# Altium project chavi-21.PrjPcb
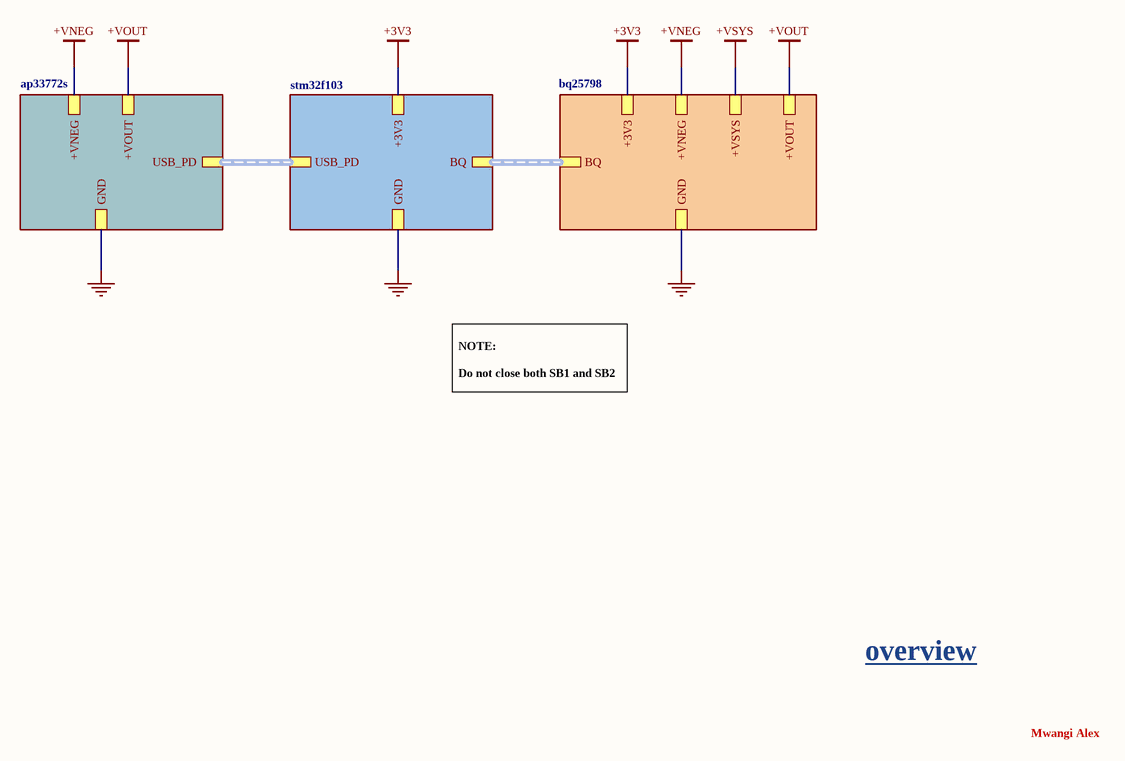
[diagram p0: overview.SchDoc]
4 sheets, 117 parts. Net scope: hierarchical (ports join the sheet entries above them; power ports are global).
Board file: chavi-21.PcbDoc
Sheets:
  overview.SchDoc
    ap33772s = ap33772s.SchDoc
    stm32f103 = stm32f103.SchDoc
    bq25798 = bq25798.SchDoc

## Sheet overview.SchDoc
size A4; SheetNumber: 1; SheetTotal: 4

### Sub-sheets
ap33772s = ap33772s.SchDoc: USB_PD (harness USB_PD), +VNEG, GND, +VOUT
bq25798 = bq25798.SchDoc: BQ (harness BQ_I2C), +VNEG, GND, +3V3, +VSYS, +VOUT
stm32f103 = stm32f103.SchDoc: USB_PD (harness USB_PD), +3V3, GND, BQ (harness BQ)

### Nets
+3V3: sheet stm32f103/+3V3, sheet bq25798/+3V3
+VNEG: sheet ap33772s/+VNEG, sheet bq25798/+VNEG
+VOUT: sheet ap33772s/+VOUT, sheet bq25798/+VOUT
GND: sheet ap33772s/GND, sheet stm32f103/GND, sheet bq25798/GND

### Buses and harness runs
harness sheet ap33772s/USB_PD = sheet stm32f103/USB_PD
harness sheet bq25798/BQ = sheet stm32f103/BQ

### Notes on the sheet
- NOTE:
  Do not close both SB1 and SB2
- overview
- Mwangi Alex

## Sheet ap33772s.SchDoc
size A4; SheetNumber: 3; SheetTotal: 4
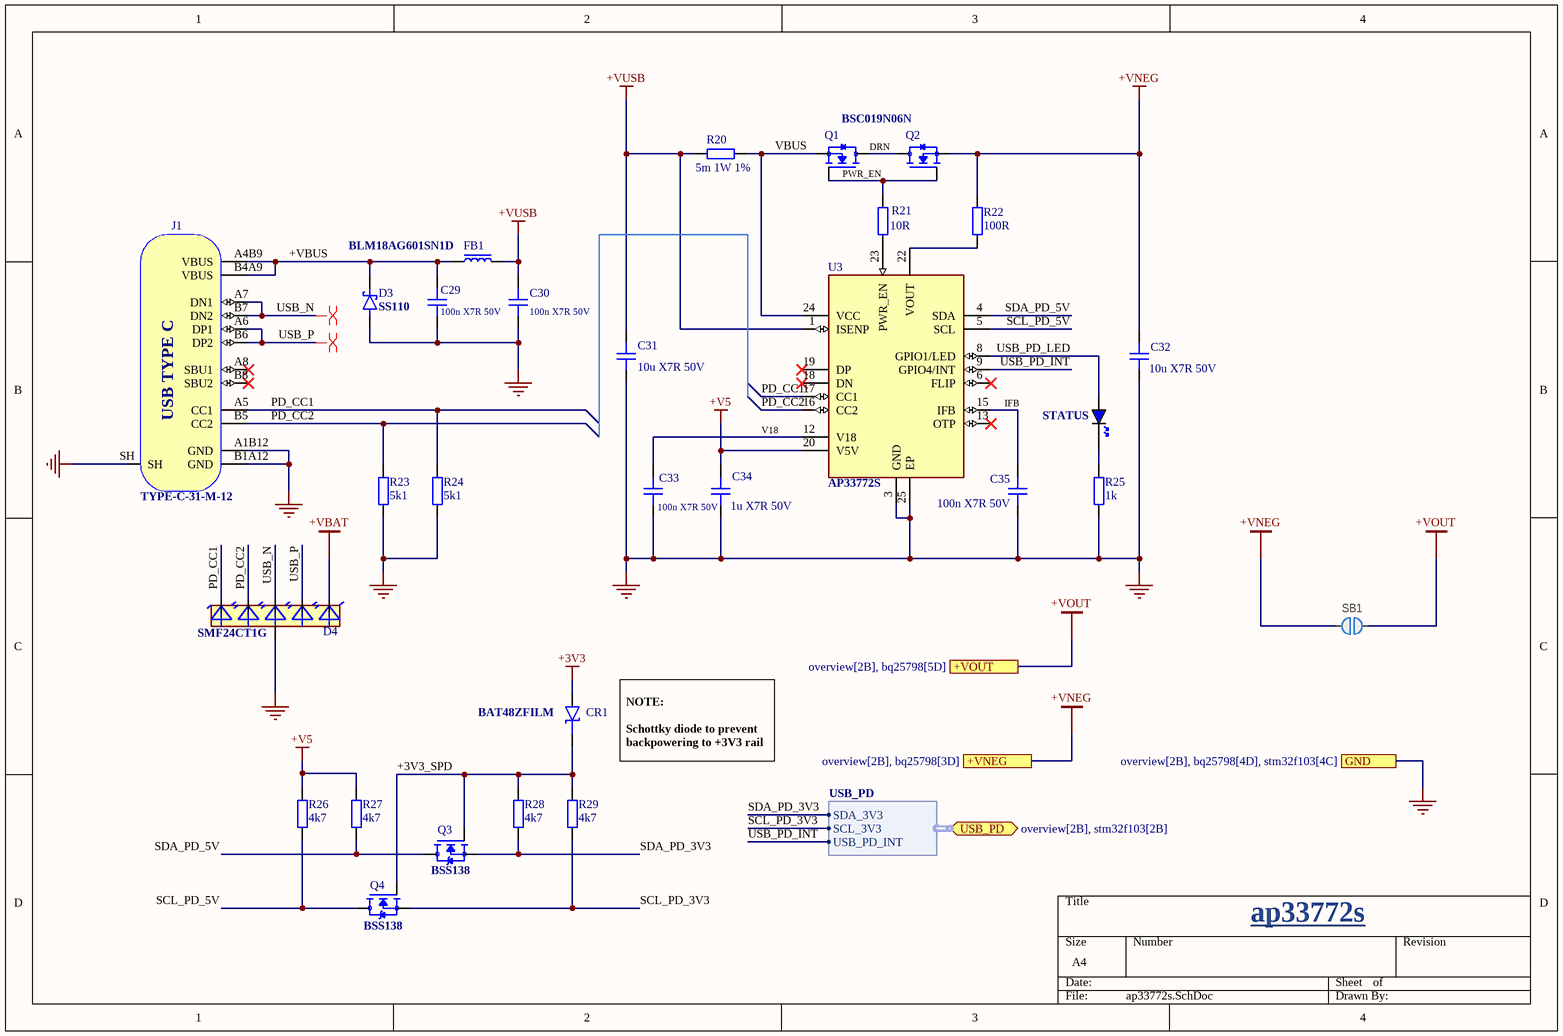
[diagram p1: ap33772s.SchDoc]

### Parts
C29  100n X7R 50V  [CAP_0603]
C30  100n X7R 50V  [CAP_0603]
C31  10u X7R 50V  [CAP_1210]
C32  10u X7R 50V  [CAP_1210]
C33  100n X7R 50V  [CAP_0603]
C34  1u X7R 50V  [CAP_0603]
C35  100n X7R 50V  [CAP_0603]
CR1  BAT48ZFILM  [*SOD-123_STM]
D3  SS110  [DIOM4325X250N]
D4  SMF24CT1G  [SOT65P210X110-6N]
FB1  BLM18AG601SN1D  [FB_0603]
J1  TYPE-C-31-M-12  [TYPE-C-31-M-12]
Q1  BSC019N06N  [BSC014N04LSIATMA1]
Q2  BSC019N06N  [BSC014N04LSIATMA1]  (value not drawn)
Q3  BSS138  [SOT95P240X111-3N]
Q4  BSS138  [SOT95P240X111-3N]
R20  5m 1W 1%  [RES_1206]
R21  10R  [RES_0603]
R22  100R  [RES_0603]
R23  5k1  [RES_0603]
R24  5k1  [RES_0603]
R25  1k  [RES_0603]
R26  4k7  [RES_0603]
R27  4k7  [RES_0603]
R28  4k7  [RES_0603]
R29  4k7  [RES_0603]
SB1  Solderbridge  [Solderbridge]  (value not drawn)  (no BOM)
STATUS  BLUE  [LED_0603_BLUE]  (value not drawn)
U3  AP33772S  [IC_AP33772S]

### Ports
+VNEG (see overview[2B], bq25798[3D]), +VOUT (see overview[2B], bq25798[5D]), GND (see overview[2B], bq25798[4D], stm32f103[4C]), USB_PD (bidir, harness USB_PD, see overview[2B], stm32f103[2B])

### Harnesses
USB_PD: SCL_3V3, SDA_3V3, USB_PD_INT

### Nets
+3V3: CR1.2
+V5: C34.2 R26.2 R27.2 U3.20(V5V)
+VBAT: D4.6(C5)
+VNEG: C32.2 Q2.1(S) R22.2 SB1.1 ; port +VNEG
+VOUT: SB1.2 ; port +VOUT
+VUSB: C30.1 C31.2 FB1.2 R20.1 U3.1(ISENP)
GND: C29.2 C30.2 C31.1 C32.1 C33.2 C34.1 C35.2 D3.A D4.2(A) J1.A1B12(GND) J1.B1A12(GND) J1.SH R23.1 R24.1 R25.2 U3.3(GND) U3.25(EP) ; port GND
+3V3_SPD: CR1.1 Q3.1(G) Q4.1(G) R28.2 R29.2
+VBUS: C29.1 D3.C(K) FB1.1 J1.A4B9(VBUS) J1.B4A9(VBUS)
DRN: Q1.5(D) Q2.5(D)
IFB: C35.1 U3.15(IFB)
PD_CC1: D4.1(C1) J1.A5(CC1) R24.2 U3.17(CC1)
PD_CC2: D4.3(C2) J1.B5(CC2) R23.2 U3.16(CC2)
PWR_EN: Q1.4(G) Q2.4(G) R21.2
SCL_PD_3V3: Q4.2(S) R29.1 ; port USB_PD.SCL_3V3
SCL_PD_5V: Q4.3(D) R26.1 U3.5(SCL)
SDA_PD_3V3: Q3.2(S) R28.1 ; port USB_PD.SDA_3V3
SDA_PD_5V: Q3.3(D) R27.1 U3.4(SDA)
USB_N: D4.4(C3) J1.A7(DN1) J1.B7(DN2)
USB_P: D4.5(C4) J1.A6(DP1) J1.B6(DP2)
USB_PD_INT: U3.9(GPIO4/INT) ; port USB_PD.USB_PD_INT
USB_PD_LED: STATUS.A U3.8(GPIO1/LED)
V18: C33.1 U3.12(V18)
VBUS: Q1.1(S) R20.2 U3.24(VCC)
NetR21_1: R21.1 U3.23(PWR_EN)
NetR22_1: R22.1 U3.22(VOUT)
NetR25_1: R25.1 STATUS.K

Not connected (* = marked no-connect by the designer): J1 A8(SBU1)* B8(SBU2)*; U3 6(FLIP)* 13(OTP)* 18(DN)* 19(DP)*

### Layout directives
differential pair: USB_N, USB_P

### Notes on the sheet
- NOTE:
  Schottky diode to prevent
  backpowering to +3V3 rail
- ap33772s
- (in symbol TYPE-C-31-M-12) USB TYPE C

### Library data of the parts
C29 C30 C33-C35 = CAP_0603: Capacitor SMD 0603; Manufacturer: *; Manufacturer Part Number: *; Distributor Link: *; LCSC: *; Rating: *; Dielectric: *
C31 C32 = CAP_1210: Capacitor SMD 1210; Manufacturer: *; Manufacturer Part Number: *; Distributor Link: *; LCSC: *; Rating: *; Dielectric: *
CR1 = BAT48ZFILM: Diode Schottky 40 V 350mA (DC) Surface Mount SOD-123; MF: STMicroelectronics; SnapEDA_Link: https://www.snapeda.com/parts/BAT48ZFILM/STMicroelectronics/view-part/?ref=snap; Package: SOD-123 STMicroelectronics; MP: BAT48ZFILM; Check_prices: https://www.snapeda.com/parts/BAT48ZFILM/STMicroelectronics/view-part/?ref=eda; Value: *
D3 = SS110: 1A, 100V, Schottky Rectifier; MF: Taiwan Semiconductor; SnapEDA_Link: https://www.snapeda.com/parts/SS110/taiwan/view-part/?ref=snap; Package: SMA-2 Taiwan Semiconductor; Value: *; MP: SS110; Check_prices: https://www.snapeda.com/parts/SS110/taiwan/view-part/?ref=eda
D4 = SMF24CT1G: Quint Uni-Directional TVS Diode, 100W, 6-Pin SC-88 | ON Semiconductor SMF24CT1G; MP: SMF05C; MF: ProTek Devices; Price: None; Availability: In Stock; Package: TSSOP-6 ProTek Devices; SnapEDA_Link: https://www.snapeda.com/parts/SMF05C/Protek+Devices/view-part/?ref=snap; Check_prices: https://www.snapeda.com/parts/SMF05C/Protek+Devices/view-part/?ref=eda; Value: *
FB1 = FB_0603: Ferrite Bead SMD 0603; Manufacturer: *; Manufacturer Part Number: *; Distributor Link: *; LCSC: *
J1 = TYPE-C-31-M-12: USB Type C Connector Horizontal SMT; Manufacturer: Koren Hroparts; Manufacturer Part Number: TYPE-C-31-M-12
Q1 Q2 = BSC019N06N: N-Channel 60 V 100A (Ta) 136W (Ta) Surface Mount PG-TDSON-8 FL; MF: Infineon; MP: IPD122N10N3 G; SnapEDA_Link: https://www.snapeda.com/parts/IPD122N10N3%20G/Infineon/view-part/?ref=snap; Package: TO-252-3 Infineon; Value: *; Check_prices: https://www.snapeda.com/parts/IPD122N10N3%20G/Infineon/view-part/?ref=eda
Q3 Q4 = BSS138: N-Channel 50 V 220mA (Ta) 350mW (Ta) Surface Mount SOT-23-3; MF: onsemi; SnapEDA_Link: https://www.snapeda.com/parts/BSS138/Onsemi/view-part/?ref=snap; Package: SOT-23-3 ON Semiconductor; Value: *; MP: BSS138; Check_prices: https://www.snapeda.com/parts/BSS138/Onsemi/view-part/?ref=eda
R20 = RES_1206: Resistor SMD 1206; Manufacturer: *; Manufacturer Part Number: *; Distributor Link: *; LCSC: *
R21-R29 = RES_0603: Resistor SMD 0603; Manufacturer: *; Manufacturer Part Number: *; Distributor Link: *; LCSC: *
SB1 = Solderbridge: Manufacturer: N.A.; Part number NEMS: 100500458; Pad Count: 2; Component Status: Active; System: Connector; Part Number: Solderbridge; Manufacturer Part Number: N.A.; LatestRevisionDate: 2009-12-14; Published: 2009-12-14; Value: Solderbridge; Note: N.A.; Artikkelnr Noca: N.A.; Footprint Doc: Solderbridge; Part number IPS: N.A.; ComponentLink1URL: N.A.; ComponentLink1Description: Datasheet; ComponentLink2URL: N.A.; ComponentLink2Description: Supplier link; HelpURL: N.A.; Supplier 1: N.A.; Supplier Part Number 1: N.A.; Supplier 2: N.A.; Supplier Part Number 2: N.A.; PartId: 100500458; Component Class: Connectors; Author: rsk; Part number Norautron: N.A.
STATUS = LED_0603_BLUE: LED 0603 BLUE SMD
U3 = AP33772S: USB Controller, PD Sink USB 3.0 USB Interface W-QFN4040-24 (Type A1); MF: Diodes Incorporated; MP: AP33771DKZ-13; Package: None; Price: None; Check_prices: https://www.snapeda.com/parts/AP33771DKZ-13/Diodes+Inc./view-part/?ref=eda; Value: *; SnapEDA_Link: https://www.snapeda.com/parts/AP33771DKZ-13/Diodes+Inc./view-part/?ref=snap; Availability: In Stock; Purchase-URL: https://pricing.snapeda.com/search?q=AP33771DKZ-13&ref=eda

## Sheet stm32f103.SchDoc
size 381 x 203 mm; SheetNumber: 4; SheetTotal: 4
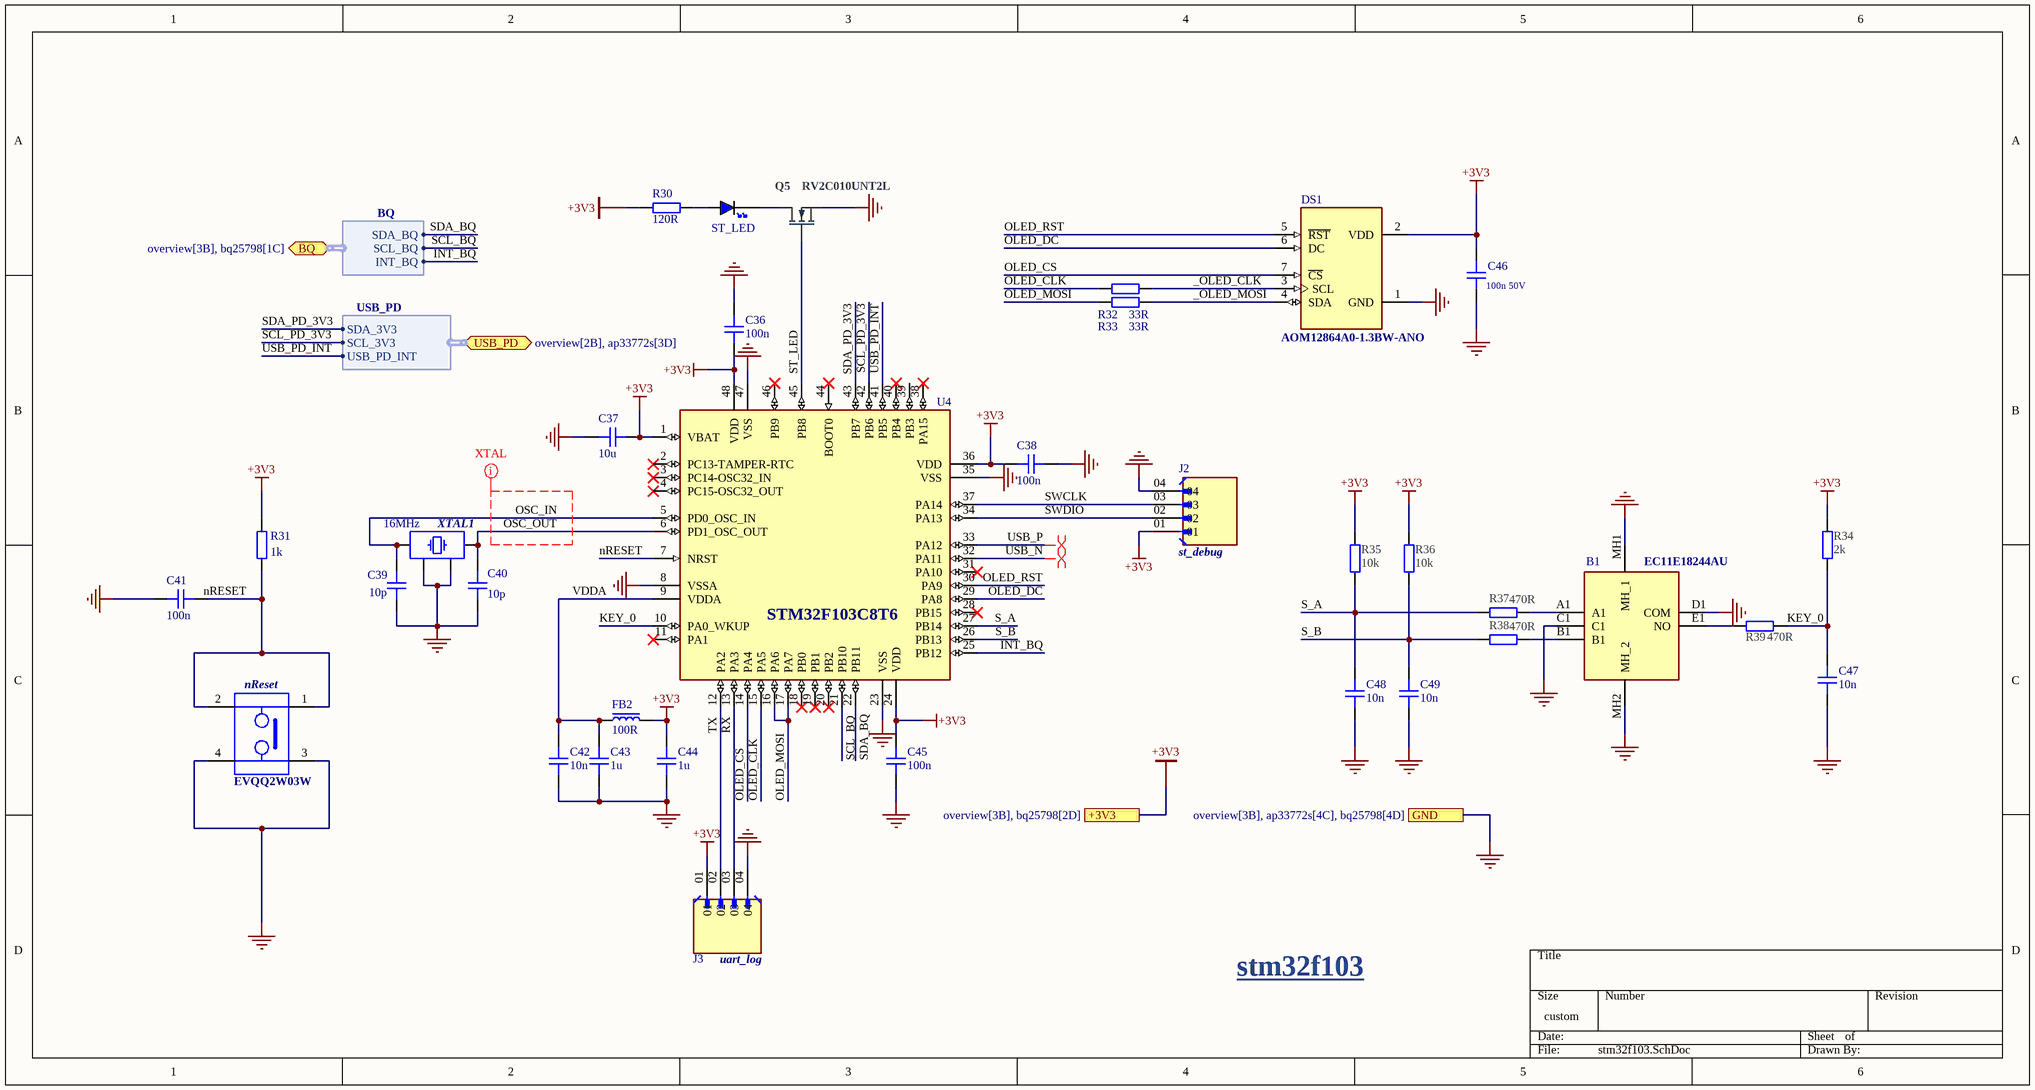
[diagram p2: stm32f103.SchDoc]

### Parts
B1  EC11E18244AU  [EC11E18244AU]
C36  100n  [CAP_0402]
C37  10u  [CAP_0402]
C38  100n  [CAP_0402]
C39  10p  [CAP_0402]
C40  10p  [CAP_0402]
C41  100n  [CAP_0603]
C42  10n  [CAP_0603]
C43  1u  [CAP_0603]
C44  1u  [CAP_0603]
C45  100n  [CAP_0402]
C46  100n 50V  [CAP_0603]
C47  10n  [CAP_0402]
C48  10n  [CAP_0402]
C49  10n  [CAP_0402]
DS1  AOM12864A0-1.3BW-ANO  [LCD_AOM12864A0-1.3BW-ANO]
FB2  100R  [FB_0603]
J2  st_debug  [SAMTEC_TSW-104-08-T-S-LL]
J3  uart_log  [SAMTEC_TSW-104-08-T-S-LL]
nReset  EVQQ2W03W  [EVQQ2W03W]
Q5  RV2C010UNT2L  [DFN65P100X40-3L]
R30  120R  [RES_0603]
R31  1k  [RES_0603]
R32  33R  [RES_0603]
R33  33R  [RES_0603]
R34  2k  [RESC1005X04L]
R35  10k  [RESC1005X04L]
R36  10k  [RESC1005X04L]
R37  470R  [RESC1005X04L]
R38  470R  [RESC1005X04L]
R39  470R  [RESC1005X04L]
ST_LED  BLUE  [LED_0603_BLUE]  (value not drawn)
U4  STM32F103C8T6  [QFP50P900X900X160-48N]
XTAL1  16MHz  [XTAL_2520]

### Ports
+3V3 (see overview[3B], bq25798[2D]), BQ (bidir, harness BQ, see overview[3B], bq25798[1C]), GND (see overview[3B], ap33772s[4C], bq25798[4D]), USB_PD (bidir, harness USB_PD, see overview[2B], ap33772s[3D])

### Harnesses
USB_PD: SCL_3V3, SDA_3V3, USB_PD_INT
BQ: SDA_BQ, SCL_BQ, INT_BQ

### Nets
+3V3: C36.2 C37.2 C38.1 C44.2 C45.2 C46.2 DS1.2(VDD) FB2.2 J2.01 J3.01 R30.2 R31.1 R34.2 R35.2 R36.2 U4.1(VBAT) U4.24(VDD) U4.36(VDD) U4.48(VDD) ; port +3V3
GND: B1.C1 B1.D1(COM) B1.MH1(MH_1) B1.MH2(MH_2) C36.1 C37.1 C38.2 C39.1 C40.1 C41.1 C42.1 C43.1 C44.1 C45.1 C46.1 C47.1 C48.1 C49.1 DS1.1(GND) J2.04 J3.04 nReset.3 nReset.4 Q5.2(S) U4.8(VSSA) U4.23(VSS) U4.35(VSS) U4.47(VSS) XTAL1.2 XTAL1.4 ; port GND
_OLED_CLK: DS1.3(SCL) R32.2
_OLED_MOSI: DS1.4(SDA) R33.2
INT_BQ: U4.25(PB12) ; port BQ.INT_BQ
KEY_0: C47.2 R34.1 R39.2 U4.10(PA0_WKUP)
nRESET: C41.2 nReset.1 nReset.2 R31.2 U4.7(NRST)
OLED_CLK: R32.1 U4.15(PA5)
OLED_CS: DS1.7(~{CS}) U4.14(PA4)
OLED_DC: DS1.6(DC) U4.29(PA8)
OLED_MOSI: R33.1 U4.16(PA6) U4.17(PA7)
OLED_RST: DS1.5(~{RST}) U4.30(PA9)
OSC_IN: C39.2 U4.5(PD0_OSC_IN) XTAL1.3
OSC_OUT: C40.2 U4.6(PD1_OSC_OUT) XTAL1.1
RX: J3.03 U4.13(PA3)
S_A: C48.2 R35.1 R37.1 U4.27(PB14)
S_B: C49.2 R36.1 R38.1 U4.26(PB13)
SCL_BQ: U4.21(PB10) ; port BQ.SCL_BQ
SCL_PD_3V3: U4.42(PB6) ; port USB_PD.SCL_3V3
SDA_BQ: U4.22(PB11) ; port BQ.SDA_BQ
SDA_PD_3V3: U4.43(PB7) ; port USB_PD.SDA_3V3
ST_LED: Q5.1(G) U4.45(PB8)
SWCLK: J2.03 U4.37(PA14)
SWDIO: J2.02 U4.34(PA13)
TX: J3.02 U4.12(PA2)
USB_N: U4.32(PA11)
USB_P: U4.33(PA12)
USB_PD_INT: U4.41(PB5) ; port USB_PD.USB_PD_INT
VDDA: C42.2 C43.2 FB2.1 U4.9(VDDA)
NetB1_A1: B1.A1 R37.2
NetB1_B1: B1.B1 R38.2
NetB1_E1: B1.E1(NO) R39.1
NetQ5_3: Q5.3(D) ST_LED.K
NetR30_1: R30.1 ST_LED.A

Not connected (* = marked no-connect by the designer): U4 2(PC13-TAMPER-RTC)* 3(PC14-OSC32_IN)* 4(PC15-OSC32_OUT)* 11(PA1)* 18(PB0)* 19(PB1)* 20(PB2)* 28(PB15)* 31(PA10)* 38(PA15)* 39(PB3) 40(PB4)* 44(BOOT0)* 46(PB9)*

### Layout directives
mark named XTAL: OSC_IN, OSC_OUT
differential pair: USB_N, USB_P

### Notes on the sheet
- stm32f103

### Library data of the parts
B1 = EC11E18244AU: Alps 18 Pulse Incremental Mechanical Rotary Encoder with a 6 mm Flat Shaft (Not Indexed), Through Hole 10mA 5V DC; Manufacturer_Name: ALPS Electric; Geometry.Height: 24.5mm; Mouser Part Number: 688-EC11E18244AU; Mouser Price/Stock: https://www.mouser.co.uk/ProductDetail/Alps-Alpine/EC11E18244AU?qs=YMSFtX0bdJDrS4vspzwcPg%3D%3D; Manufacturer_Part_Number: EC11E18244AU; Datasheet Link: https://tech.alpsalpine.com/cms.media/product_catalog_ec_01_ec11e_en_611f078659.pdf
C36-C40 C45 C47-C49 = CAP_0402: Capacitor SMD 0402; Manufacturer: *; Manufacturer Part Number: *; Distributor Link: *; LCSC: *; Rating: *; Dielectric: *
C41-C44 C46 = CAP_0603: Capacitor SMD 0603; Manufacturer: *; Manufacturer Part Number: *; Distributor Link: *; LCSC: *; Rating: *; Dielectric: *
DS1 = AOM12864A0-1.3BW-ANO: Non-Touch Graphic LCD Display Module - Blue OLED SPI 1.3 (33.02mm) 128 x 64; MF: Orient Display; SnapEDA_Link: https://www.snapeda.com/parts/AOM12864A0-1.3BW-ANO/Orient+Display/view-part/?ref=snap; Package: None; Value: *; MP: AOM12864A0-1.3BW-ANO; Check_prices: https://www.snapeda.com/parts/AOM12864A0-1.3BW-ANO/Orient+Display/view-part/?ref=eda
FB2 = FB_0603: Ferrite Bead SMD 0603; Manufacturer: *; Manufacturer Part Number: *; Distributor Link: *; LCSC: *
J2 J3 = 4PIN_TSW-104-08-T-S-LL: MF: Samtec; Availability: Unavailable; Value: *; Package: None; Price: None; MP: TSW-104-08-T-S-LL
nReset = EVQQ2W03W: White Push Plate Tactile Switch, SPST-NO 20 mA 3.1mm; MF: Panasonic; Package: None; Check_prices: https://www.snapeda.com/parts/EVQQ2W03W/Panasonic/view-part/?ref=eda; SnapEDA_Link: https://www.snapeda.com/parts/EVQQ2W03W/Panasonic/view-part/?ref=snap; Price: None; Availability: In Stock; MP: EVQQ2W03W; Value: *
Q5 = RV2C010UNT2L: N-Channel MOSFET, 20V, 1A, 470mOhm, 400mW; Manufacturer: Rohm Semiconductor; Part number IPS: 00000009976; Part number Norautron: 26320026; Part number NEMS: 101300132; Note: N.A.; Artikkelnr Noca: 35010020; Pad Count: 3; Component Status: Active; Part Number: RV2C010UNT2L; Manufacturer Part Number: RV2C010UNT2L; ComponentLink1URL: N.A.; ComponentLink1Description: Datasheet; ComponentLink2URL: N.A.; ComponentLink2Description: Supplier link; HelpURL: http://rohmfs.rohm.com/en/products/databook/datasheet/discrete/transistor/mosfet/rv2c010unt2l-e.pdf; Footprint Doc: DFN-3; LatestRevisionDate: 2016-08-09; Published: 2016-08-09; Value: RV2C010UNT2L; Supplier 1: Digi-Key; Supplier Part Number 1: RV2C010UNT2LCT-ND; Supplier 2: Mouser; Supplier Part Number 2: 755-RV2C010UNT2L; PartId: 101300132; Component Class: Semiconductors; Author: rsk
R30-R33 = RES_0603: Resistor SMD 0603; Manufacturer: *; Manufacturer Part Number: *; Distributor Link: *; LCSC: *
R34-R39 = R0402-0R: Resistor, ±5%, 0.063W; Manufacturer: N.A.; Part number IPS: 00000007128; Part number NEMS: 100100109; Value: 0R; Note: Chip Res 5%; Artikkelnr Noca: 27049000; Pad Count: 2; Component Status: Active; Part Number: R0402-0R; Manufacturer Part Number: N.A.; ComponentLink1URL: N.A.; ComponentLink1Description: Datasheet; ComponentLink2URL: N.A.; ComponentLink2Description: Supplier link; HelpURL: N.A.; Footprint Doc: 0402; LatestRevisionDate: 2009-11-23; Published: 2009-05-08; Supplier 1: Farnell; Supplier Part Number 1: 146-9661; Supplier 2: N.A.; Supplier Part Number 2: N.A.; PartId: 100100109; Component Class: Resistors; Author: rsk; Part number Norautron: N.A.
ST_LED = LED_0603_BLUE: LED 0603 BLUE SMD
U4 = STM32F103C8T6: ARMÂ® CortexÂ®-M3 STM32F1 Microcontroller IC 32-Bit 72MHz 64KB (64K x 8) FLASH 48-LQFP (7x7); MF: STMicroelectronics; Package: LQFP-48 STMicroelectronics; Price: None; Check_prices: https://www.snapeda.com/parts/STM32F103C8T6/STMicroelectronics/view-part/?ref=eda; Value: *; SnapEDA_Link: https://www.snapeda.com/parts/STM32F103C8T6/STMicroelectronics/view-part/?ref=snap; MP: STM32F103C8T6; Availability: In Stock; Purchase-URL: https://pricing.snapeda.com/search/part/STM32F103C8T6/?ref=eda
XTAL1 = XTAL_2520: Crystal SMD 2520; Distributor Link: *

## Sheet bq25798.SchDoc
size 381 x 241 mm; SheetNumber: 2; SheetTotal: 4
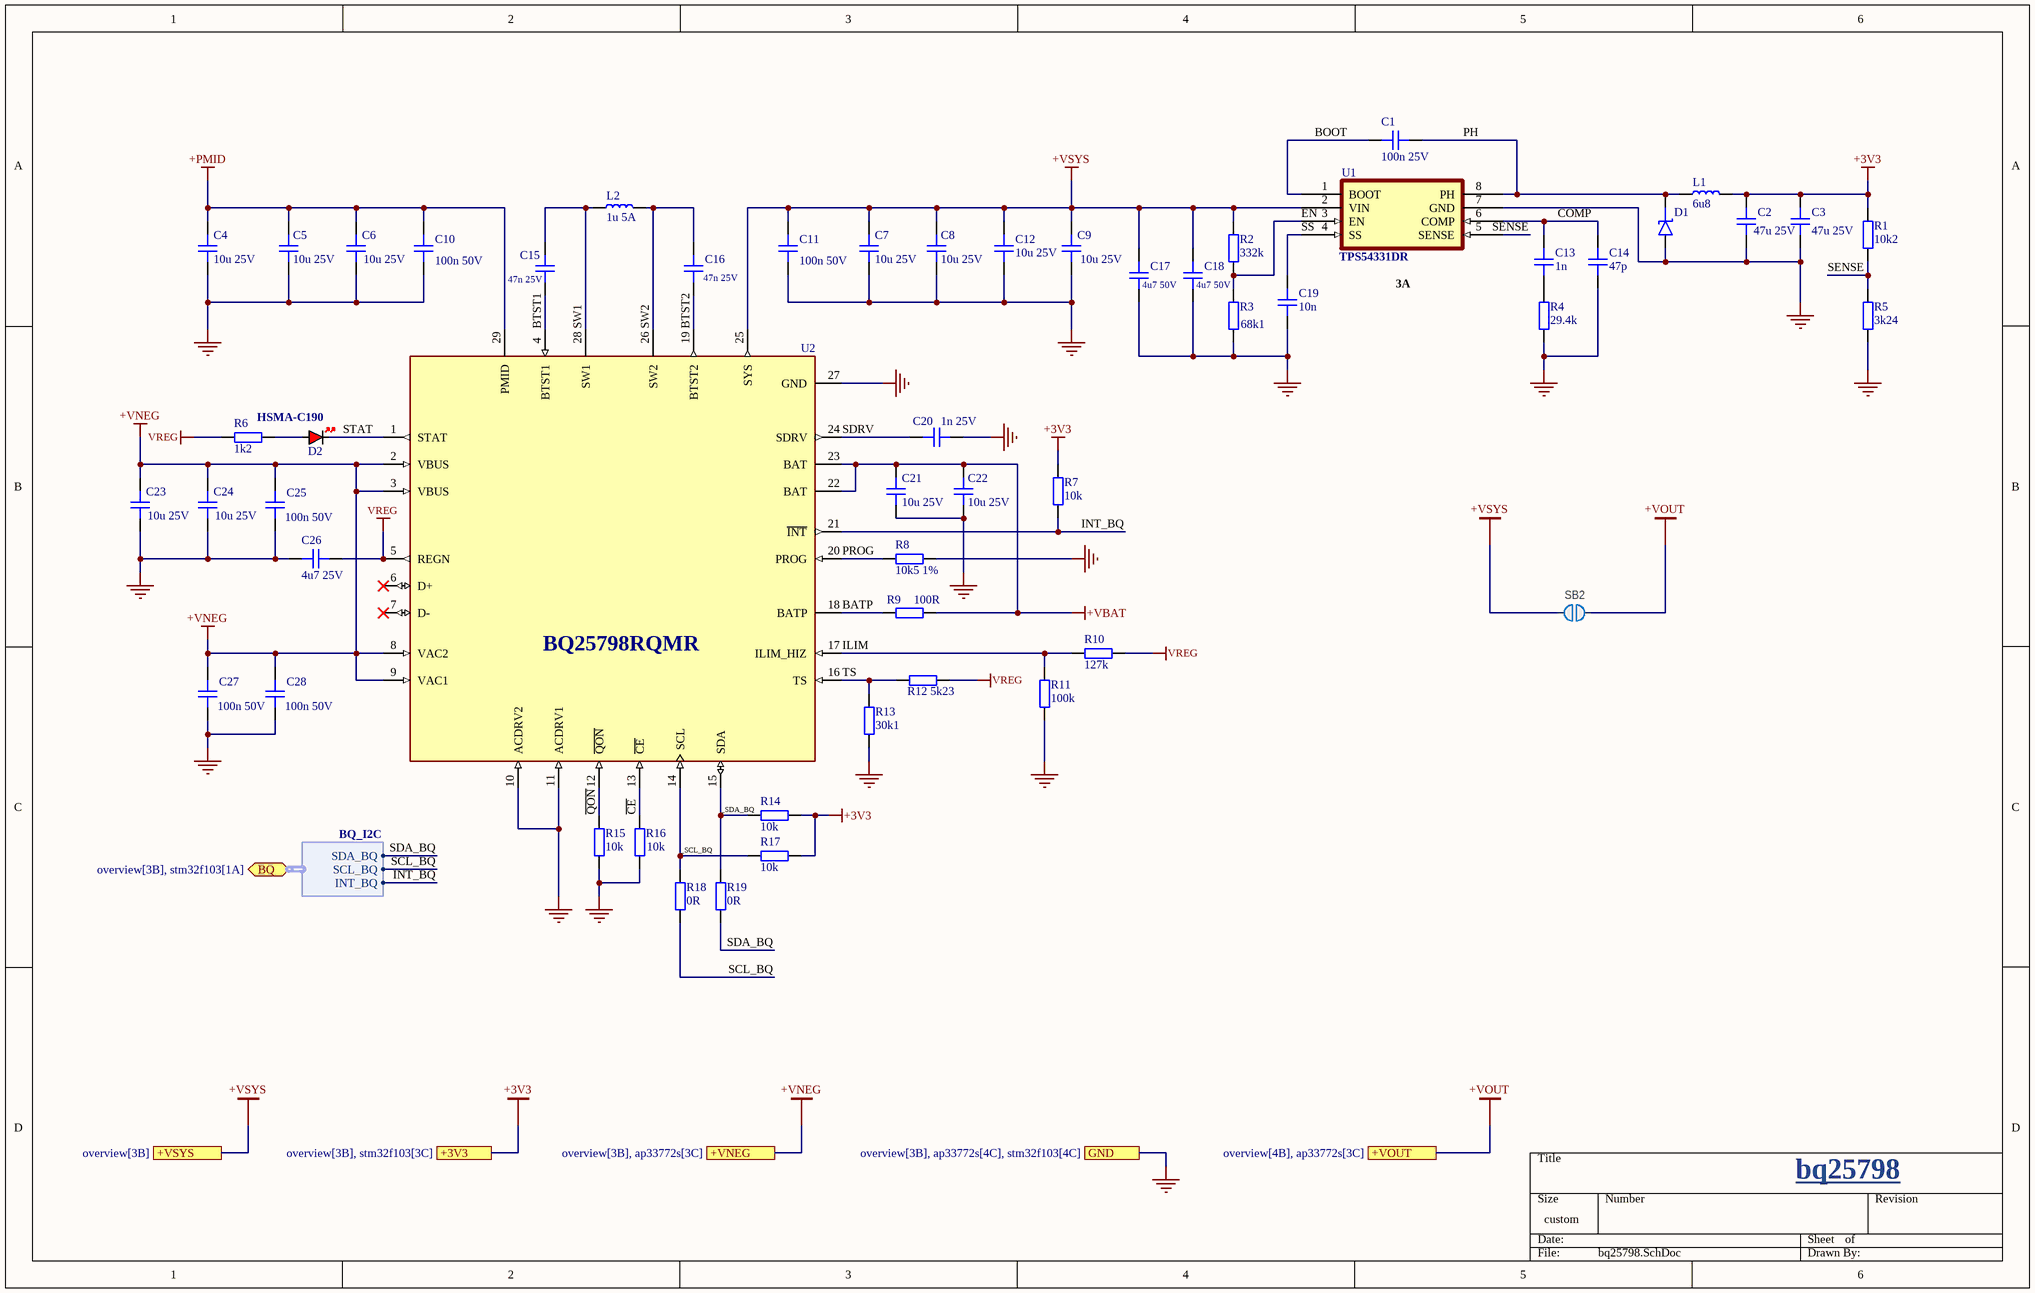
[diagram p3: bq25798.SchDoc]

### Parts
C1  100n 25V  [CAP_0805]
C2  47u 25V  [CAP_1206]
C3  47u 25V  [CAP_1206]
C4  10u 25V  [CAP_0603]
C5  10u 25V  [CAP_0603]
C6  10u 25V  [CAP_0603]
C7  10u 25V  [CAP_0603]
C8  10u 25V  [CAP_0603]
C9  10u 25V  [CAP_0603]
C10  100n 50V  [CAP_0402]
C11  100n 50V  [CAP_0402]
C12  10u 25V  [CAP_0603]
C13  1n  [CAP_0603]
C14  47p  [CAP_0402]
C15  47n 25V  [CAP_0603]
C16  47n 25V  [CAP_0603]
C17  4u7 50V  [CAP_1206]
C18  4u7 50V  [CAP_1206]
C19  10n  [CAP_0603]
C20  1n 25V  [CAP_0603]
C21  10u 25V  [CAP_0603]
C22  10u 25V  [CAP_0603]
C23  10u 25V  [CAP_0603]
C24  10u 25V  [CAP_0603]
C25  100n 50V  [CAP_0402]
C26  4u7 25V  [CAP_0402]
C27  100n 50V  [CAP_0402]
C28  100n 50V  [CAP_0402]
D1  Schottky Diode_3  [DIOM5226X100N]  (value not drawn)
D2  HSMA-C190  [LED_HSMA-C190]
L1  6u8  [ASPI-0630HI-6R8M-T15]
L2  1u 5A  [IND_AMPLA4020S1R0MT]
R1  10k2  [RES_0603]
R2  332k  [RES_0603]
R3  68k1  [RES_0805]
R4  29.4k  [RES_0603]
R5  3k24  [RES_0603]
R6  1k2  [RES_0603]
R7  10k  [RES_0603]
R8  10k5 1%  [RES_0603]
R9  100R  [RES_0603]
R10  127k  [RES_0603]
R11  100k  [RES_0603]
R12  5k23  [RES_0603]
R13  30k1  [RES_0603]
R14  10k  [RES_0603]
R15  10k  [RES_0603]
R16  10k  [RES_0603]
R17  10k  [RES_0603]
R18  0R  [RES_0603]
R19  0R  [RES_0603]
SB2  Solderbridge  [Solderbridge]  (value not drawn)  (no BOM)
U1  TPS54331DR  [SOIC127P599X175-8N]
U2  BQ25798RQMR  [IC_BQ25798RQMR]

### Ports
+3V3 (see overview[3B], stm32f103[3C]), +VNEG (see overview[3B], ap33772s[3C]), +VOUT (see overview[4B], ap33772s[3C]), +VSYS (see overview[3B]), BQ (bidir, harness BQ_I2C, see overview[3B], stm32f103[1A]), GND (see overview[3B], ap33772s[4C], stm32f103[4C])

### Harnesses
BQ_I2C: SDA_BQ, SCL_BQ, INT_BQ

### Nets
+3V3: C2.2 C3.2 L1.2 R1.2 R7.2 R14.2 R17.1 ; port +3V3
+PMID: C4.2 C5.2 C6.2 C10.2 U2.29(PMID)
+VBAT: C21.2 C22.2 R9.2 U2.22(BAT) U2.23(BAT)
+VNEG: C23.2 C24.2 C25.2 C27.2 C28.2 U2.2(VBUS) U2.3(VBUS) U2.8(VAC2) U2.9(VAC1) ; port +VNEG
+VOUT: SB2.1 ; port +VOUT
+VSYS: C7.2 C8.2 C9.2 C11.2 C12.2 C17.2 C18.2 R2.2 SB2.2 U1.2(VIN) U2.25(SYS) ; port +VSYS
GND: C2.1 C3.1 C4.1 C5.1 C6.1 C7.1 C8.1 C9.1 C10.1 C11.1 C12.1 C14.1 C17.1 C18.1 C19.1 C20.2 C21.1 C22.1 C23.1 C24.1 C25.1 C26.2 C27.1 C28.1 D1.A R3.1 R4.1 R5.1 R8.1 R11.1 R13.1 R15.1 R16.1 U1.7(GND) U2.10(ACDRV2) U2.11(ACDRV1) U2.27(GND) ; port GND
VREG: C26.1 R6.1 R10.2 R12.2 U2.5(REGN)
_SCL_BQ: R17.2 R18.1 U2.14(SCL)
_SDA_BQ: R14.1 R19.2 U2.15(SDA)
BATP: R9.1 U2.18(BATP)
BOOT: C1.1 U1.1(BOOT)
BTST1: C15.1 U2.4(BTST1)
BTST2: C16.1 U2.19(BTST2)
~{CE}: R16.2 U2.13(~{CE})
COMP: C13.2 C14.2 U1.6(COMP)
EN: R2.1 R3.2 U1.3(EN)
ILIM: R10.1 R11.2 U2.17(ILIM_HIZ)
INT_BQ: R7.1 U2.21(~{INT}) ; port BQ.INT_BQ
PH: C1.2 D1.K L1.1 U1.8(PH)
PROG: R8.2 U2.20(PROG)
~{QON}: R15.2 U2.12(~{QON})
SCL_BQ: R18.2 ; port BQ.SCL_BQ
SDA_BQ: R19.1 ; port BQ.SDA_BQ
SDRV: C20.1 U2.24(SDRV)
SENSE: R1.1 R5.2 U1.5(SENSE)
SS: C19.2 U1.4(SS)
STAT: D2.K U2.1(STAT)
SW1: C15.2 L2.1 U2.28(SW1)
SW2: C16.2 L2.2 U2.26(SW2)
TS: R12.1 R13.2 U2.16(TS)
NetC13_1: C13.1 R4.2
NetD2_A: D2.A R6.2

Not connected (* = marked no-connect by the designer): U2 6(D+)* 7(D-)*

### Notes on the sheet
- (near U1) 3A
- bq25798

### Library data of the parts
C1 = CAP_0805: Capacitor SMD 0805; Manufacturer: *; Manufacturer Part Number: *; Distributor Link: *; LCSC: *; Rating: *; Dielectric: *
C2 C3 C17 C18 = CAP_1206: Capacitor SMD 1206; Manufacturer: *; Manufacturer Part Number: *; Distributor Link: *; LCSC: *; Rating: *; Dielectric: *
C4-C9 C12 C13 C15 C16 C19-C24 = CAP_0603: Capacitor SMD 0603; Manufacturer: *; Manufacturer Part Number: *; Distributor Link: *; LCSC: *; Rating: *; Dielectric: *
C10 C11 C14 C25-C28 = CAP_0402: Capacitor SMD 0402; Manufacturer: *; Manufacturer Part Number: *; Distributor Link: *; LCSC: *; Rating: *; Dielectric: *
D1 = Schottky Diode_3: Schottky Diode SMD SMAF package
D2 = HSMA-C190: 20mA White Lens 90mcd 592nm Amber 170° 1.9V 0603 LED Indication - Discrete ROHS; Package: None; Price: None; Value: *; MP: HSMA-C190; Availability: Unavailable
L1 = ASPI-0630HI-6R8M-T15: Inductor SMD 6.8uH 20% 8A Shielded; Manufacturer: ABRACON; Manufacturer Part Number: ASPI-0630HI-6R8M-T15
L2 = AMPLA4020S1R0MT: Inductor Power Shielded/Molded Wirewound 1uH 20% 100KHz Carbonyl Powder 5A 0.027Ohm DCR 1616 T/R; MF: Abracon; SnapEDA_Link: https://www.snapeda.com/parts/AMPLA4020S1R0MT/Abracon/view-part/?ref=snap; Package: Package; Value: *; MP: AMPLA4020S1R0MT; Check_prices: https://www.snapeda.com/parts/AMPLA4020S1R0MT/Abracon/view-part/?ref=eda
R1 R2 R4-R19 = RES_0603: Resistor SMD 0603; Manufacturer: *; Manufacturer Part Number: *; Distributor Link: *; LCSC: *
R3 = RES_0805: Resistor SMD 0805; Manufacturer: *; Manufacturer Part Number: *; Distributor Link: *; LCSC: *
SB2 = Solderbridge: as SB1 on sheet ap33772s; Part Number: Solderbridge; Manufacturer Part Number: N.A.; LatestRevisionDate: 2009-12-14; Published: 2009-12-14; Value: Solderbridge; Note: N.A.; Artikkelnr Noca: N.A.; Footprint Doc: Solderbridge; Part number IPS: N.A.; ComponentLink1URL: N.A.; ComponentLink1Description: Datasheet; ComponentLink2URL: N.A.; ComponentLink2Description: Supplier link; HelpURL: N.A.; Supplier 1: N.A.; Supplier Part Number 1: N.A.; Supplier 2: N.A.; Supplier Part Number 2: N.A.; PartId: 100500458; Component Class: Connectors; Author: rsk; Part number Norautron: N.A.
U2 = BQ25798RQMR: IÂ²C controlled, 1-4-cell, 5-A buck-boost solar battery charger with dual-input selector and MPPT; MF: Texas Instruments; SnapEDA_Link: https://www.snapeda.com/parts/BQ25798RQMR/Texas+Instruments/view-part/?ref=snap; Package: VFQFN-29 Texas Instruments; Value: *; MP: BQ25798RQMR; Check_prices: https://www.snapeda.com/parts/BQ25798RQMR/Texas+Instruments/view-part/?ref=eda

## Nets that join several sheets
+3V3: ap33772s (CR1.2), stm32f103 (19 pins), bq25798 (7 pins)
+VBAT: ap33772s (D4.6), bq25798 (5 pins)
+VNEG: ap33772s (C32.2 Q2.1 R22.2 SB1.1), bq25798 (9 pins)
+VOUT: ap33772s (SB1.2), bq25798 (SB2.1)
GND: ap33772s (17 pins), stm32f103 (30 pins), bq25798 (37 pins)
INT_BQ: stm32f103 (U4.25), bq25798 (R7.1 U2.21)
SCL_BQ: stm32f103 (U4.21), bq25798 (R18.2)
SCL_PD_3V3: ap33772s (Q4.2 R29.1), stm32f103 (U4.42)
SDA_BQ: stm32f103 (U4.22), bq25798 (R19.1)
SDA_PD_3V3: ap33772s (Q3.2 R28.1), stm32f103 (U4.43)
USB_PD_INT: ap33772s (U3.9), stm32f103 (U4.41)